# EAGLE design MightyWatt R3 (EAGLE 6.5.0)
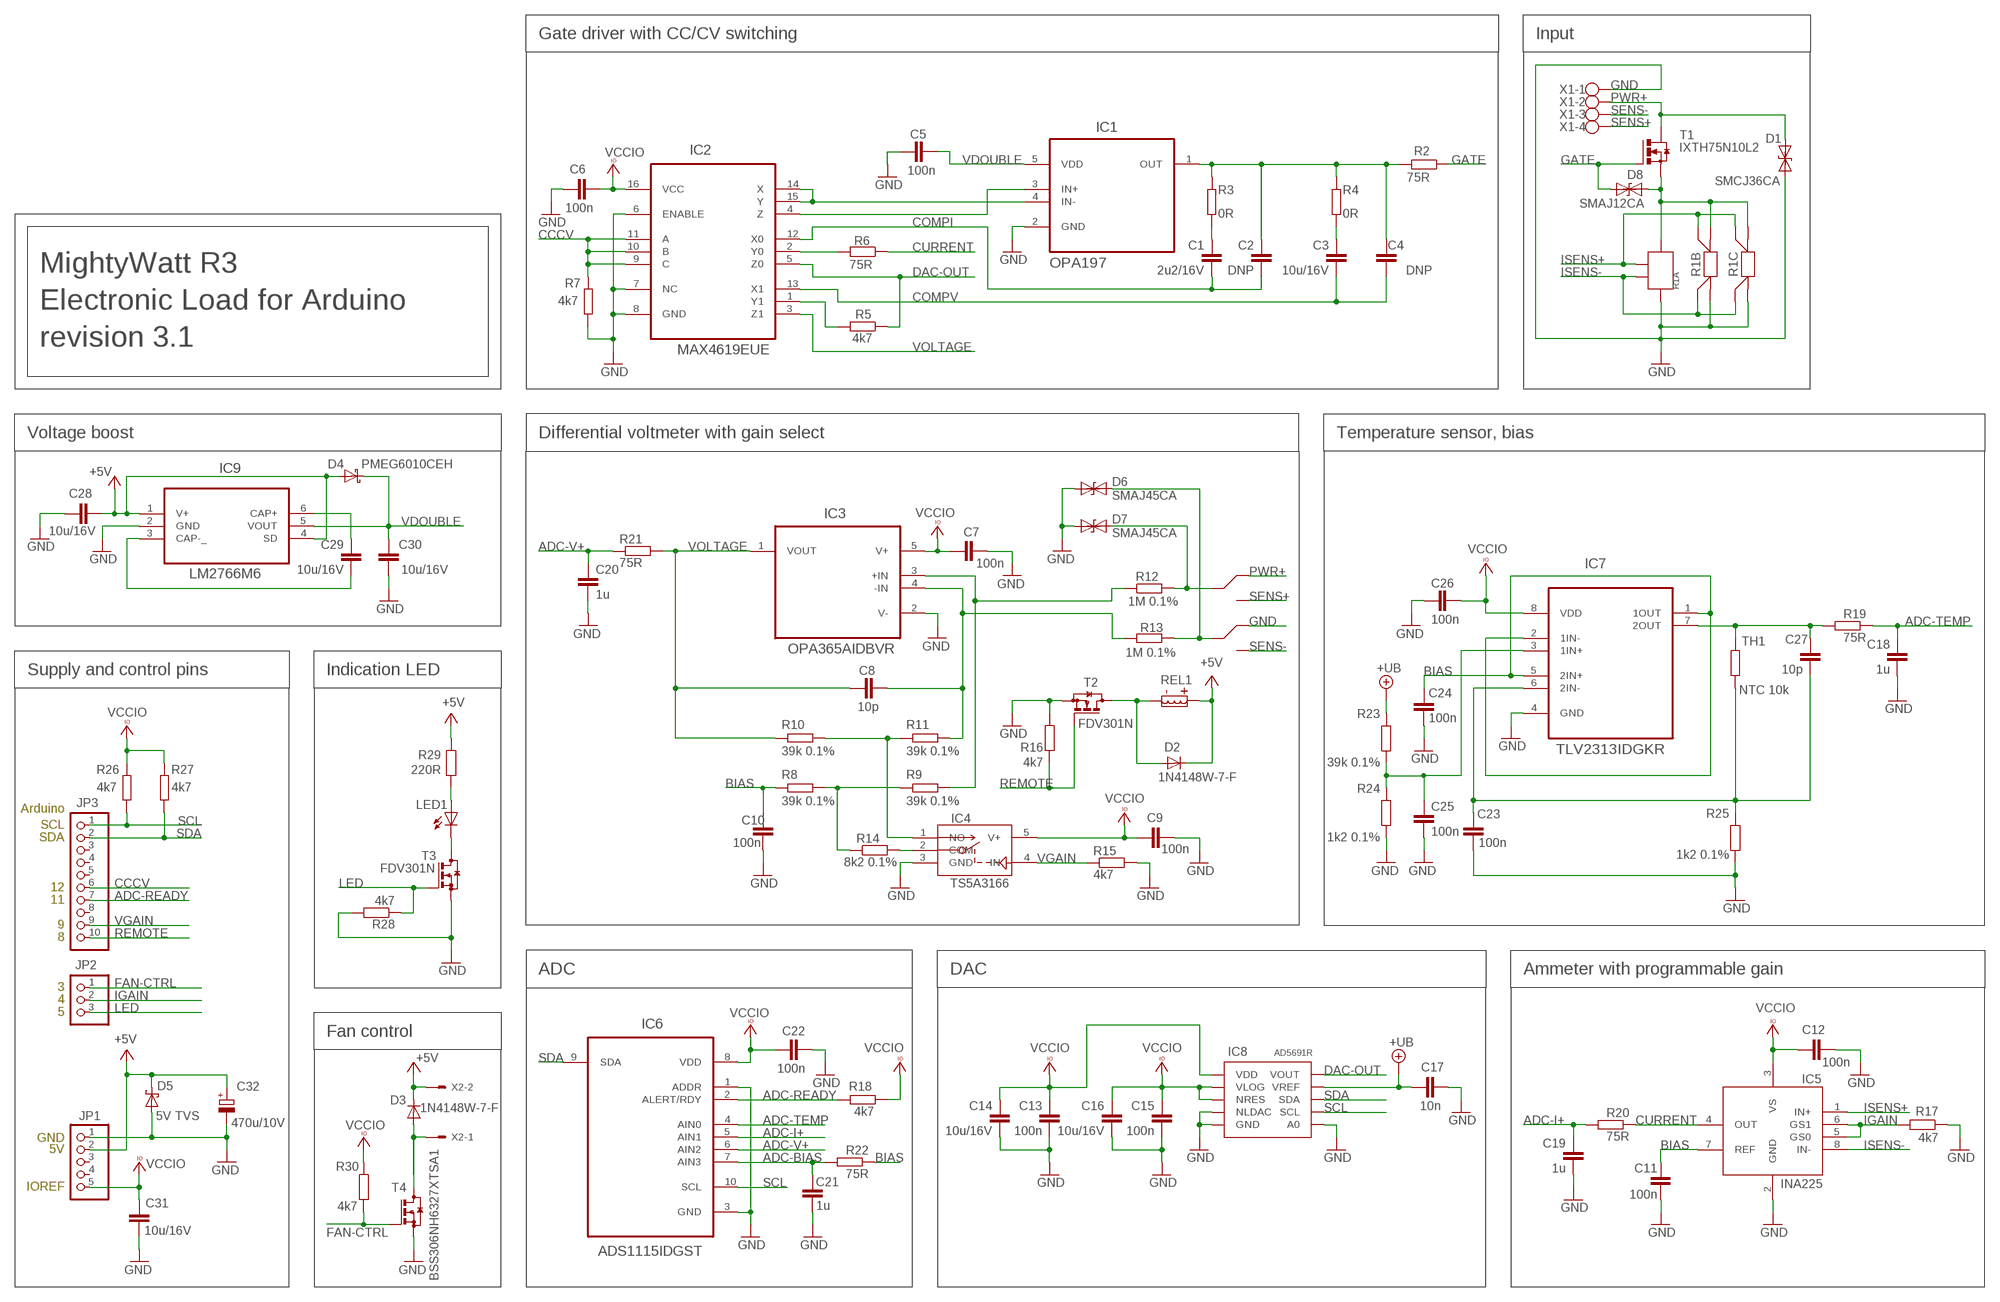
[diagram p0: schematic, sheet 1]

## Parts
C1  2u2/16V  C-EUC1206  [C1206]
C2  DNP  C-EUC0603  [C0603]
C3  10u/16V  C-EUC1206  [C1206]
C4  DNP  C-EUC0603  [C0603]
C5  100n  C-EUC0603  [C0603]
C6  100n  C-EUC0603  [C0603]
C7  100n  C-EUC0603  [C0603]
C8  10p  C-EUC0603  [C0603]
C9  100n  C-EUC0603  [C0603]
C10  100n  C-EUC0603  [C0603]
C11  100n  C-EUC0603  [C0603]
C12  100n  C-EUC0603  [C0603]
C13  100n  C-EUC0603  [C0603]
C14  10u/16V  C-EUC1206  [C1206]
C15  100n  C-EUC0603  [C0603]
C16  10u/16V  C-EUC1206  [C1206]
C17  10n  C-EUC0603  [C0603]
C18  1u  C-EUC0603  [C0603]
C19  1u  C-EUC0603  [C0603]
C20  1u  C-EUC0603  [C0603]
C21  1u  C-EUC0603  [C0603]
C22  100n  C-EUC0603  [C0603]
C23  100n  C-EUC0603  [C0603]
C24  100n  C-EUC0603  [C0603]
C25  100n  C-EUC0603  [C0603]
C26  100n  C-EUC0603  [C0603]
C27  10p  C-EUC0603  [C0603]
C28  10u/16V  C-EUC1206  [C1206]
C29  10u/16V  C-EUC1206  [C1206]
C30  10u/16V  C-EUC1206  [C1206]
C31  10u/16V  C-EUC1206  [C1206]
C32  470u/10V  CPOL-EUSMCE  [SMC_E]
D1  SMCJ36CA  DIODE2SMC  [SMC]
D2  1N4148W-7-F  DIODE-SOD123  [SOD123]
D3  1N4148W-7-F  DIODE-SOD123  [SOD123]
D4  PMEG6010CEH  DIODE-SOD123  [SOD123]
D5  5V TVS  SCHOTTKY-DIODESMD  [SMB]
D6  SMAJ45CA  DIODE2DO-214AC  [DO-214AC]
D7  SMAJ45CA  DIODE2DO-214AC  [DO-214AC]
D8  SMAJ12CA  DIODE2DO-214AC  [DO-214AC]
IC1  TLV271IDBVR  [SOT95P280X145-5N]
IC2  MAX4619EUE  [SOP65P640X120-16N]
IC3  OPA365AIDBVR  [SOT95P280X145-5N]
IC4  TS5A3166  [SC70-5]
IC5  INA225  [MSOP8]
IC6  ADS1115IDGST  [SOP50P490X110-10N]
IC7  TLV2372IDGK  [SOP65P490X110-8N]
IC8  AD5691RAD5691R  [SOP50P490X110-10N]
IC9  LM2766M6  [SOT95P285X122-6N]
JP1  SUPPLY  PINHD-1X5  [1X05]
JP2  CONTROL, LED  PINHD-1X3  [1X03]
JP3  TWI  PINHD-1X10  [1X10]
LED1  LEDCHIP-LED0805  [CHIP-LED0805]
R1A  WSL3637  [POWER-R-4TERM]
R1B  LVK24  [LVK24]
R1C  LVK12  [1206-4WIRE]
R2  75R  R-EU_R0603  [R0603]
R3  0R  R-EU_R0603  [R0603]
R4  0R  R-EU_R0603  [R0603]
R5  4k7  R-EU_R0603  [R0603]
R6  75R  R-EU_R0603  [R0603]
R7  4k7  R-EU_R0603  [R0603]
R8  39k 0.1%  R-EU_R0603  [R0603]
R9  39k 0.1%  R-EU_R0603  [R0603]
R10  39k 0.1%  R-EU_R0603  [R0603]
R11  39k 0.1%  R-EU_R0603  [R0603]
R12  1M 0.1%  R-EU_R0603  [R0603]
R13  1M 0.1%  R-EU_R0603  [R0603]
R14  8k2 0.1%  R-EU_R0603  [R0603]
R15  4k7  R-EU_R0603  [R0603]
R16  4k7  R-EU_R0603  [R0603]
R17  4k7  R-EU_R0603  [R0603]
R18  4k7  R-EU_R0603  [R0603]
R19  75R  R-EU_R0603  [R0603]
R20  75R  R-EU_R0603  [R0603]
R21  75R  R-EU_R0603  [R0603]
R22  75R  R-EU_R0603  [R0603]
R23  39k 0.1%  R-EU_R0603  [R0603]
R24  1k2 0.1%  R-EU_R0603  [R0603]
R25  1k2 0.1%  R-EU_R0603  [R0603]
R26  4k7  R-EU_R0603  [R0603]
R27  4k7  R-EU_R0603  [R0603]
R28  4k7  R-EU_R0603  [R0603]
R29  220R  R-EU_R0603  [R0603]
R30  4k7  R-EU_R0603  [R0603]
REL1  IM03NS  [IM03NS-NARROW-RELAY]
T1  IXTH75N10L2  [TO247-BLANK]
T2  BSS123  [SOT23]
T3  BSS123  [SOT23]
T4  BSS123  [SOT23]
TH1  NTC 10k  R-EU_R0402  [R0402]
X1  W237-4  [W237-4]
X2  22-23-2021  [22-23-2021]

## Nets
+5V: C28.1 C32.+ D2.C D3.C D4.A D5.C IC9.1(V+) IC9.4(SD) JP1.2 R29.1 REL1.P$1(COIL:C+) X2.2
+UB: C17.2 IC8.9(VREF) R23.2
ADC-BIAS: C21.2 IC6.7(AIN3) R22.2
ADC-I+: C19.2 IC6.5(AIN1) R20.2
ADC-READY: IC6.2(ALERT/RDY) JP3.7 R18.1
ADC-TEMP: C18.2 IC6.4(AIN0) R19.1
ADC-V+: C20.2 IC6.6(AIN2) R21.1
BIAS: C10.2 C11.2 C24.2 IC5.7(REF) IC7.1(1OUT) IC7.2(1IN-) IC7.5(2IN+) R8.1 R22.1
CCCV: IC2.9(C) IC2.10(B) IC2.11(A) JP3.6 R7.2
COMPI: C1.1 C2.1 IC2.12(X0)
COMPV: C3.1 C4.1 IC2.13(X1)
CURRENT: IC5.4(OUT) R6.1 R20.1
DAC-OUT: IC2.5(Z0) IC8.10(VOUT) R5.1
FAN-CTRL: JP2.1 R30.2 T4.1(G)
GATE: D8.C R2.1 T1.G
GND: C5.1 C6.2 C7.2 C9.1 C10.1 C11.1 C12.2 C13.1 C14.2 C15.1 C16.2 C17.1 C18.1 C19.1 C20.1 C21.1 C22.2 C23.1 C24.1 C25.1 C26.2 C28.2 C30.2 C31.2 C32.- D1.A D5.A D6.A D7.A IC1.2(GND) IC2.6(ENABLE) IC2.7(NC) IC2.8(GND) IC3.2(V-) IC4.3(GND) IC5.2(GND) IC6.1(ADDR) IC6.3(GND) IC7.4(GND) IC8.4(NLDAC) IC8.5(GND) IC8.6(A0) IC9.2(GND) JP1.1 R1A.POWER1 R1B.I1 R1C.I1 R7.1 R15.2 R16.1 R17.1 R24.1 R25.1 R28.2 REL1.P$2(S1:NC) T2.2(S) T3.2(S) T4.2(S) X1.1
IGAIN: IC5.5(GS0) IC5.6(GS1) JP2.2 R17.2
ISENS+: IC5.1(IN+) R1A.SENSE2 R1B.V2 R1C.V2
ISENS-: IC5.8(IN-) R1A.SENSE1 R1B.V1 R1C.V1
LED: JP2.3 R28.1 T3.1(G)
N$1: IC1.3(IN+) IC2.4(Z)
N$2: IC2.2(Y0) R6.2
N$3: C23.2 C27.1 IC7.6(2IN-) R25.2 TH1.1
N$4: LED1.C T3.3(D)
N$5: C29.1 IC9.6(CAP+)
N$6: C29.2 IC9.3(CAP-_)
N$9: C1.2 R3.2
N$10: IC1.4(IN-) IC2.14(X) IC2.15(Y)
N$11: D8.A R1A.POWER2 R1B.I2 R1C.I2 T1.S
N$12: C2.2 C4.2 IC1.1(OUT) R2.2 R3.1 R4.1
N$13: D7.C R12.2 REL1.P$6(S2:COM)
N$14: C27.2 IC7.7(2OUT) R19.2 TH1.2
N$15: IC2.1(Y1) R5.2
N$16: LED1.A R29.2
N$17: D6.C R13.1 REL1.P$3(S1:COM)
N$18: C3.2 R4.2
N$20: C25.2 IC7.3(1IN+) R23.1 R24.2
N$22: C8.2 IC3.4(-IN) R11.2 R13.2
N$24: D2.A REL1.P$8(COIL:C-) T2.3(D)
N$26: D3.A T4.3(D) X2.1
N$30: IC4.1(NO) R10.2 R11.1
N$34: IC3.3(+IN) R9.2 R12.1
N$36: IC4.2(COM) R14.2
N$37: R8.2 R9.1 R14.1
PWR+: D1.C REL1.P$7(S2:NC) T1.D X1.2
REMOTE: JP3.10 R16.2 T2.1(G)
SCL: IC6.10(SCL) IC8.7(SCL) JP3.1 R26.1
SDA: IC6.9(SDA) IC8.8(SDA) JP3.2 R27.1
SENS+: REL1.P$5(S2:NO) X1.4
SENS-: REL1.P$4(S1:NO) X1.3
VCCIO: C6.1 C7.1 C9.2 C12.1 C13.2 C14.1 C15.2 C16.1 C22.1 C26.1 C31.1 IC2.16(VCC) IC3.5(V+) IC4.5(V+) IC5.3(VS) IC6.8(VDD) IC7.8(VDD) IC8.1(VDD) IC8.2(VLOG) IC8.3(NRES) JP1.5 R18.2 R26.2 R27.2 R30.1
VDOUBLE: C5.2 C30.1 D4.C IC1.5(VDD) IC9.5(VOUT)
VGAIN: IC4.4(IN) JP3.9 R15.1
VOLTAGE: C8.1 IC2.3(Z1) IC3.1(VOUT) R10.1 R21.2
Unconnected: JP1.3 JP1.4 JP3.3 JP3.4 JP3.5 JP3.8

## Notes on the sheet
- Gate driver with CC/CV switching | Input
- MightyWatt R3
  Electronic Load for Arduino
  revision 3.1
- Voltage boost | Differential voltmeter with gain select | Temperature sensor, bias
- Supply and control pins | Indication LED
- Arduino
- SCL
- SDA
- 12
- 11
- 9
- 8
- ADC | DAC | Ammeter with programmable gain
- 3
- 4
- 5
- Fan control
- GND
- 5V
- IOREF

## Library data of the parts
C1-C31 = rcl:C-EU: CAPACITOR, European symbol
C32 = rcl:CPOL-EU: POLARIZED CAPACITOR, European symbol; PARTN: TPSB476K010R0250
D1 D6-D8 = kaktus:DIODE2: DIODE
D2 D3 = diode:DIODE-: DIODE
D4 = diode-schottky:DIODE-: DIODE
D5 = diode:SCHOTTKY-DIODE: Schottky Diode
IC1 = Texas Instruments_By_element14_Batch_1:TLV271IDBVR: OPERATIONAL AMPLIFIERS; MPN: OPA197; OC_FARNELL: 1575646; OC_NEWARK: 76C8471; PACKAGE: SOT-23-5; SUPPLIER: Texas Instruments
IC2 = kaktus:MAX4619EUE: SPDT Switches; PACKAGE: TSSOP-16
IC3 = Texas Instruments_By_element14_Batch_1:OPA365AIDBVR: 50MHz, Low-Distortion, High CMRR RRI/O, Single-Supply OPERATIONAL AMPLIFIER; MPN: OPA365AIDBVR; OC_FARNELL: -; OC_NEWARK: 03M9400; PACKAGE: SOT-23-5; SUPPLIER: Texas Instruments
IC4 = load:TS5A3166: 0.9-Ohm SPST analog switch
IC5 = ina225:INA225
IC6 = Texas Instruments_By_element14_Batch_1:ADS1115IDGST: Analog-to-Digital Converter with Internal Reference; MPN: ADS1015IDGST; OC_FARNELL: 1762981; OC_NEWARK: 25R1241; PACKAGE: MSOP-10; SUPPLIER: Texas Instruments
IC7 = Texas Instruments_By_element14_Batch_1:TLV2372IDGK: Operatinal Amplifiers; MPN: TLV2313IDGKR; OC_FARNELL: -; OC_NEWARK: 76C7973; PACKAGE: MSOP-8; SUPPLIER: Texas Instruments
IC8 = r2.5-3:AD5691R: Analog Devices AD5691R 12-bit DAC I2C, REF out; MODEL: AD5691R
IC9 = texas:LM2766M6: IC SW CAP/DBLR ADJ 20MA; MPN: LM2766M6; OC_FARNELL: 1685633; OC_NEWARK: 41K4345; PACKAGE: SOT-23-6; SUPPLIER: National Semiconductor
JP1 = pinhead:PINHD-1X5: PIN HEADER
JP2 = pinhead:PINHD-1X3: PIN HEADER
JP3 = pinhead:PINHD-1X10: PIN HEADER
LED1 = led:LED: LED OSRAM: - CHIPLED LG R971, LG N971, LY N971, LG Q971, LY Q971, LO R971, LY R971 LH N974, LH R974 LS Q976, LO Q976, LY Q976 LO Q996 - Hyper CHIPLED LW Q18S LB Q993, LB Q99A, LB R99A - SideLED LS A670, LO A670, LY A670, LG A670, LP A670 LB A673, LV A673, LT A673, LW A673 LH A674 LY A675 LS A676, LA A676, LO A676, LY A676, LW A676 LS A679, LY A679, LG A679 - Hyper Micro SIDELED® LS Y876, LA Y876, LO Y876, LY Y876 LT Y87S - SmartLED LW L88C, LW L88S LB L89C, LB L89S, LG L890 LS L89K, LO L89K, LY L89K LS L896, LA L896, LO L896, LY L896 - TOPLED LS T670, LO T670, LY T670, LG T670, LP T670 LSG T670, LSP T670, LSY T670, LOP T670, LYG T670 LG T671, LOG T671, LSG T671 LB T673, LV T673, LT T673, LW T673 LH T674 LS T676, LA T676, LO T676, LY T676, LB T676, LH T676, LSB T676, LW T676 LB T67C, LV T67C, LT T67C, LS T67K, LO T67K, LY T67K, LW E67C LS E67B, LA E67B, LO E67B, LY E67B, LB E67C, LV E67C, LT E67C LW T67C LS T679, LY T679, LG T679 LS T770, LO T770, LY T770, LG T770, LP T770 LB T773, LV T773, LT T773, LW T773 LH T774 LS E675, LA E675, LY E675, LS T675 LS T776, LA T776, LO T776, LY T776, LB T776 LHGB T686 LT T68C, LB T68C - Hyper Mini TOPLED® LB M676 - Mini TOPLED Santana® LG M470 LS M47K, LO M47K, LY M47K Source: http://www.osram.convergy.de LUXEON: - LUMILED® LXK2-PW12-R00, LXK2-PW12-S00, LXK2-PW14-U00, LXK2-PW14-V00 LXK2-PM12-R00, LXK2-PM12-S00, LXK2-PM14-U00 LXK2-PE12-Q00, LXK2-PE12-R00, LXK2-PE12-S00, LXK2-PE14-T00, LXK2-PE14-U00 LXK2-PB12-K00, LXK2-PB12-L00, LXK2-PB12-M00, LXK2-PB14-N00, LXK2-PB14-P00, LXK2-PB14-Q00 LXK2-PR12-L00, LXK2-PR12-M00, LXK2-PR14-Q00, LXK2-PR14-R00 LXK2-PD12-Q00, LXK2-PD12-R00, LXK2-PD12-S00 LXK2-PH12-R00, LXK2-PH12-S00 LXK2-PL12-P00, LXK2-PL12-Q00, LXK2-PL12-R00 Source: www.luxeon.com KINGBRIGHT: KA-3528ASYC Source: www.kingbright.com
R1A = moje:WSL3637
R1B = kaktus:LVK24: LVK24 Four Terminal Current Sense Resistor
R1C = kaktus:LVK12: Current shunt resistor Ohmite LVK12 series
R2-R30 TH1 = rcl:R-EU_: RESISTOR, European symbol
REL1 = kaktus:IM03NS: Relay DPDT THT narrow 5V: IM03NS, UA2-5NU; REL1: REL1
T1 = kaktus:IXTH75N10L2: N-Channel Enhancement Power MOISFET Linear L2 Power MOSFET w/extended FBSOA
T2 T3 = transistor-small-signal:BSS123: N-CHANNEL MOS FET; PARTNAME: FDV301N
T4 = transistor-small-signal:BSS123: N-CHANNEL MOS FET; PARTNAME: BSS306NH6327XTSA1
X1 = con-wago-500-modified:W237-4: WAGO SCREW CLAMP; OC_FARNELL: unknown; OC_NEWARK: unknown
X2 = con-molex:22-23-2021: .100" (2.54mm) Center Header - 2 Pin; MF: MOLEX; MPN: 22-23-2021; OC_FARNELL: 1462926; OC_NEWARK: 25C3832

## Board
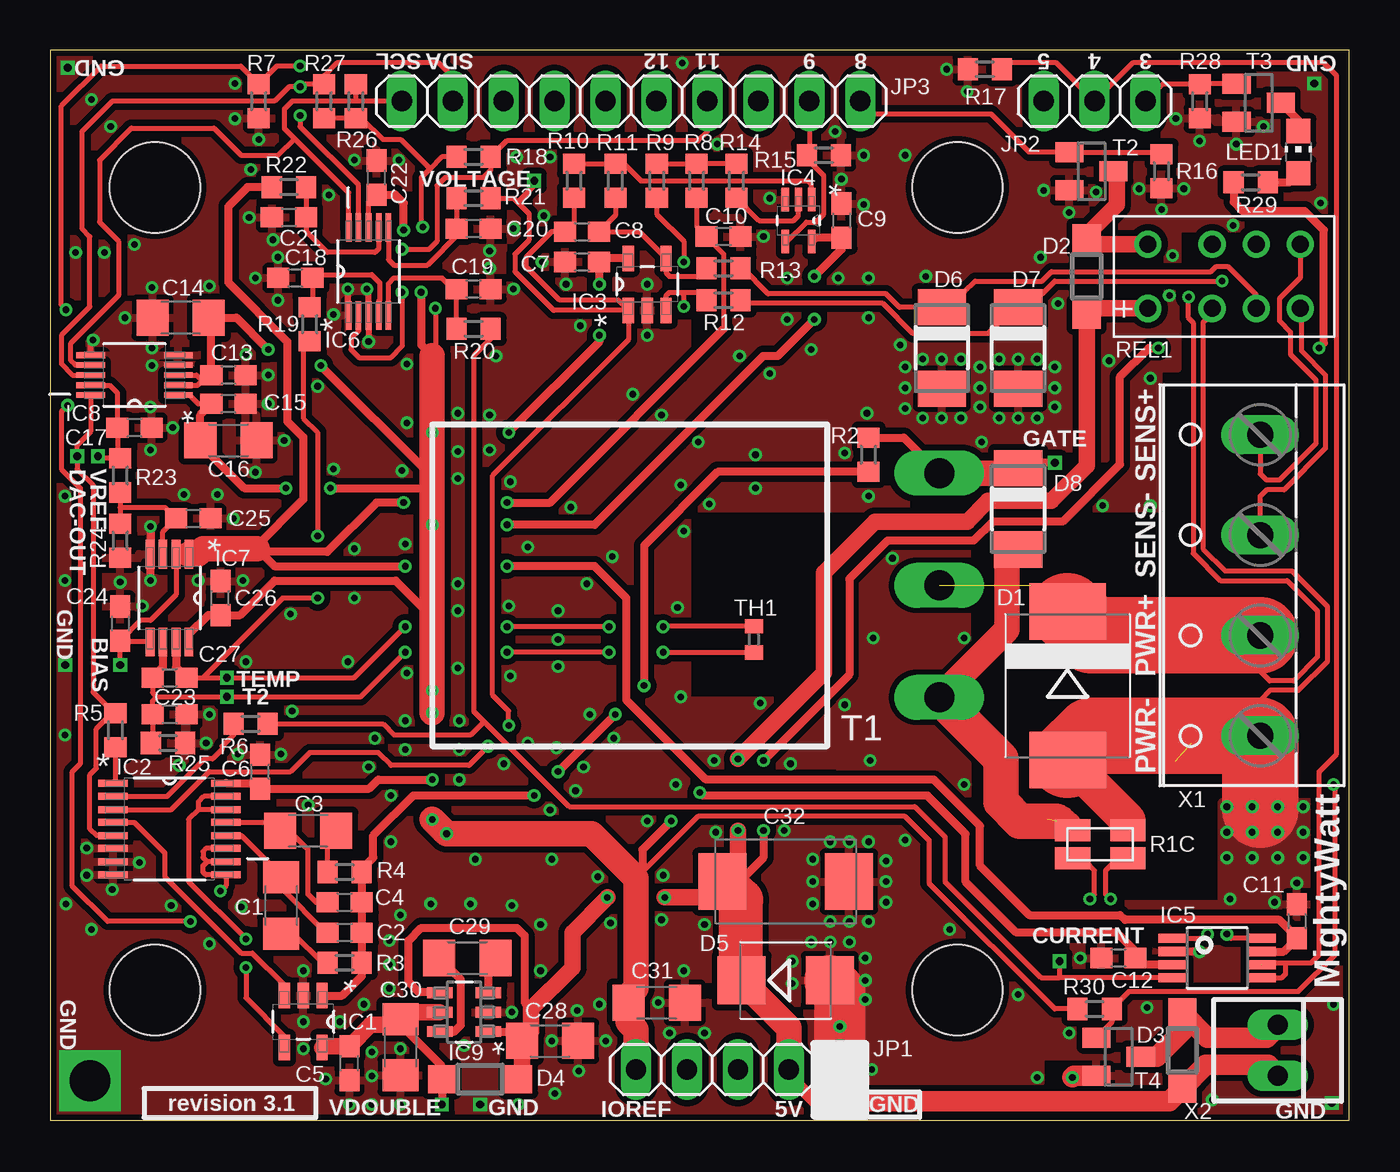
[diagram p1: board, top side]
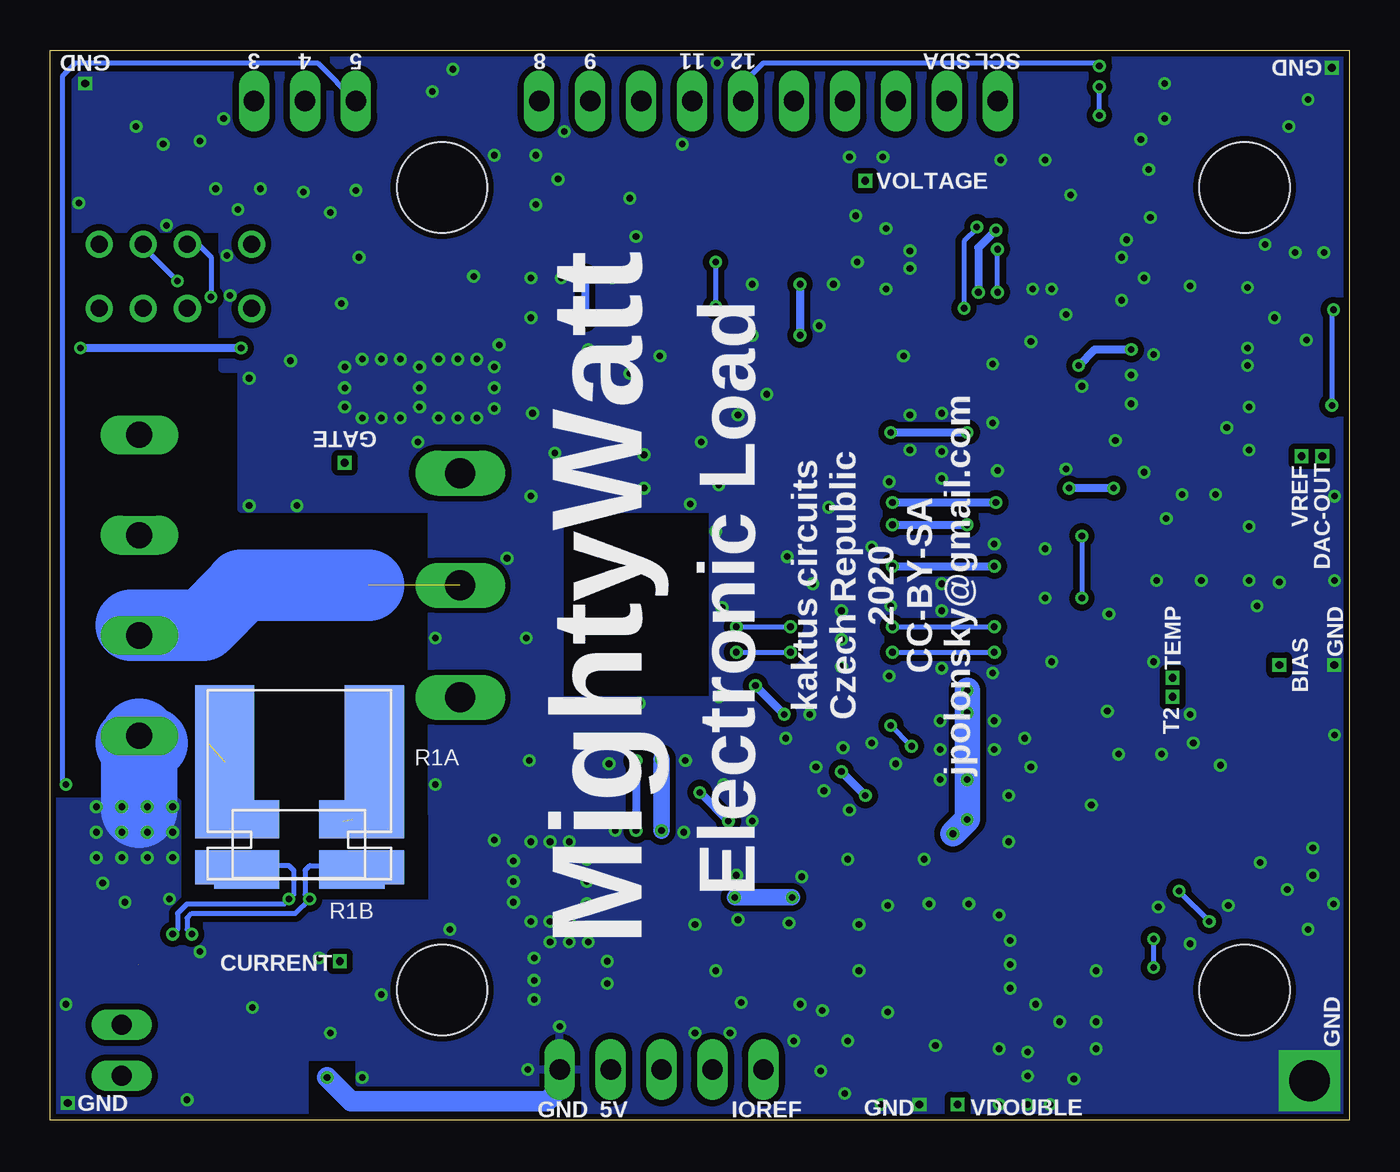
[diagram p2: board, bottom side, seen from below]

Size 64.77 x 53.34 mm. Coordinates in mm from the lower left corner, seen from the top.
Outline: 0,0 64.77,0 64.77,53.34 0,53.34 0,0
Copper layers (1*16): Top 0.035mm / dielectric 1.5mm / Bottom 0.035mm
Design rules "SeeedStudio_2layer_DRU_no_angle_20140221 *": minimum track width 6mil, minimum drill 12mil, track to track 6mil, track to pad 6mil, pad to pad 6mil, via to via 6mil, smd to smd 0mil, copper to edge 10mil, drill to drill 10mil, minimum pad ring 10mil, minimum via ring 6mil, stop-mask expansion 2mil, vias tented up to drill 14mil, thermal gap 10mil
Holes 4.5 mm at 5.23,6.5 5.23,46.5 45.23,46.5 45.23,6.5

### Footprints (pad centres in the part's own frame; a part is rotated, then mirrored left to right if it is on the bottom)
C1206 = smd 1.6 x 1.8: 1 -1.4,0; 2 1.4,0
C0603 = smd 1.1 x 1: 1 -0.85,0; 2 0.85,0
SMC_E = smd 2.4 x 2.8: + -3.15,0; - 3.15,0
SMC = smd 2.8 x 3.8: A 3.7,0; C -3.7,0
SOD123 = smd 1.4 x 1.4: A 1.9,0; C -1.9,0
SMB = smd 2.4 x 2.4: A 2.2,0; C -2.2,0
DO-214AC = smd 1.8 x 2.4: A 2.025,0; C -2.025,0
SOT95P280X145-5N = smd 1.27 x 0.559: 1 -1.295,0.94; 2 -1.295,0; 3 -1.295,-0.94; 4 1.295,-0.94; 5 1.295,0.94
SOP65P640X120-16N = smd 1.473 x 0.356: 1 -2.819,2.286; 2 -2.819,1.626; 3 -2.819,0.965; 4 -2.819,0.33; 5 -2.819,-0.33; 6 -2.819,-0.965; 7 -2.819,-1.626; 8 -2.819,-2.286; 9 2.819,-2.286; 10 2.819,-1.626; 11 2.819,-0.965; 12 2.819,-0.33; 13 2.819,0.33; 14 2.819,0.965; 15 2.819,1.626; 16 2.819,2.286
SC70-5 = smd 1.168 x 0.356: 1 -1.041,0.66; 2 -1.041,0; 3 -1.041,-0.66; 4 1.041,-0.66; 5 1.041,0.66
MSOP8 = smd 0.45 x 1.45: 1 -0.975,-2.2; 2 -0.325,-2.2; 3 0.325,-2.2; 4 0.975,-2.2; 5 0.975,2.2; 6 0.325,2.2; 7 -0.325,2.2; 8 -0.975,2.2
SOP50P490X110-10N = smd 1.422 x 0.279: 1 -2.184,0.991; 2 -2.184,0.508; 3 -2.184,0; 4 -2.184,-0.508; 5 -2.184,-0.991; 6 2.184,-0.991; 7 2.184,-0.508; 8 2.184,0; 9 2.184,0.508; 10 2.184,0.991
SOP65P490X110-8N = smd 1.422 x 0.432: 1 -2.184,0.965; 2 -2.184,0.33; 3 -2.184,-0.33; 4 -2.184,-0.965; 5 2.184,-0.965; 6 2.184,-0.33; 7 2.184,0.33; 8 2.184,0.965
SOT95P285X122-6N = smd 1.27 x 0.533: 1 -1.219,0.965; 2 -1.219,0; 3 -1.219,-0.965; 4 1.219,-0.965; 5 1.219,0; 6 1.219,0.965
1X05 = drill 1.016 long: 1 -5.08,0; 2 -2.54,0; 3 0,0; 4 2.54,0; 5 5.08,0
1X03 = drill 1.016 long: 1 -2.54,0; 2 0,0; 3 2.54,0
1X10 = drill 1.016 long: 1 -11.43,0; 2 -8.89,0; 3 -6.35,0; 4 -3.81,0; 5 -1.27,0; 6 1.27,0; 7 3.81,0; 8 6.35,0; 9 8.89,0; 10 11.43,0
CHIP-LED0805 = smd 1.2 x 1.2: A 0,-1.05; C 0,1.05
POWER-R-4TERM = smd 7.62 x 2.946: POWER1 1.016,-2.972; POWER2 1.016,4.496 | smd 1.676 x 2.946: SENSE1 6.274,-2.972; SENSE2 6.274,4.496
LVK24 = smd 3.25 x 1.9: I1 -2.65,1.25; I2 2.6,1.25; V1 -2.65,-1.25; V2 2.6,-1.25
1206-4WIRE = smd 1.75 x 1.1: I1 -1.4,-0.7; I2 1.35,-0.7; V1 -1.4,0.7; V2 1.35,0.7
R0603 = smd 1 x 1.1: 1 -0.85,0; 2 0.85,0
IM03NS-NARROW-RELAY = drill 0.85: P$1 -2.5,-1.6; P$2 0.7,-1.6; P$3 2.9,-1.6; P$4 5.1,-1.6; P$5 5.1,1.6; P$6 2.9,1.6; P$7 0.7,1.6; P$8 -2.5,1.6
TO247-BLANK = drill 1.499 long: D 0,-10.16; G -5.588,-10.16; S 5.588,-10.16
SOT23 = smd 1 x 1.4: 1 -0.95,-1.1; 2 0.95,-1.1; 3 0,1.1
R0402 = smd 0.7 x 0.9: 1 -0.65,0; 2 0.65,0
W237-4 = drill 1.3 long: 1 -7.5,-1.27; 2 -2.5,-1.27; 3 2.5,-1.27; 4 7.5,-1.27
22-23-2021 = drill 1 long: 1 -1.27,0; 2 1.27,0

### Placement (x,y rotation side)
C1  11.51,10.72 270 top
C2  14.68,9.37 0 top
C3  12.86,14.45 0 top
C4  14.68,10.87 0 top
C5  14.92,2.86 90 top
C6  10.48,17.38 90 top
C7  26.51,42.78 180 top
C8  26.51,44.29 0 top
C9  39.45,44.85 270 top
C10  33.58,44.05 180 top
C11  62.15,9.92 270 top
C12  53.26,8.1 180 top
C13  8.89,37.15 180 top
C14  6.51,40.01 180 top
C15  8.89,35.72 180 top
C16  8.89,33.89 0 top
C17  4.21,34.53 180 top
C18  12.22,41.99 0 top
C19  21.11,41.43 180 top
C20  21.11,44.45 180 top
C21  11.91,45.01 0 top
C22  16.27,46.99 90 top
C23  5.95,20.24 180 top
C24  3.49,24.77 270 top
C25  7.14,30 180 top
C26  8.49,26.04 90 top
C27  5.95,22.07 0 top
C28  24.92,3.97 0 top
C29  20.8,8.1 0 top
C30  17.46,3.65 270 top
C31  30.24,5.87 0 top
C32  36.67,11.91 0 top
D1  50.72,21.67 270 top
D2  51.67,42.07 90 top
D3  56.44,3.49 90 top
D4  21.43,2.06 0 top
D5  36.67,6.99 0 top
D6  44.45,38.5 270 top
D7  48.26,38.5 270 top
D8  48.26,30.48 270 top
IC1  12.62,4.92 270 top
IC2  5.95,14.53 0 top
IC3  29.77,41.67 90 top
IC4  37.31,44.85 270 top
IC5  58.18,8.1 270 top
IC6  15.88,42.31 90 top
IC7  5.95,26.04 270 top
IC8  4.21,37.15 180 top
IC9  20.64,5.4 180 top
JP1  34.29,2.54 180 top
JP2  52.07,50.8 0 top
JP3  28.96,50.8 0 top
LED1  62.23,48.26 0 top
R1A  53.1,18.89 270 bottom
R1B  52.32,13.76 0 bottom
R1C  52.32,13.76 180 top
R2  40.8,33.18 270 top
R3  14.68,7.86 180 top
R4  14.68,12.38 180 top
R5  3.25,19.45 270 top
R6  10,19.76 180 top
R7  10.4,50.8 90 top
R8  32.23,46.83 90 top
R9  30.24,46.83 270 top
R10  26.11,46.83 90 top
R11  28.18,46.83 270 top
R12  33.58,40.88 0 top
R13  33.58,42.47 180 top
R14  34.21,46.83 270 top
R15  38.58,48.1 0 top
R16  55.4,47.31 90 top
R17  46.59,52.39 0 top
R18  21.11,48.02 180 top
R19  12.94,39.69 270 top
R20  21.11,39.45 180 top
R21  21.11,45.96 0 top
R22  11.91,46.51 0 top
R23  3.49,32.15 90 top
R24  3.49,28.89 90 top
R25  5.87,18.81 180 top
R26  15.24,50.8 270 top
R27  13.65,50.8 270 top
R28  57.31,50.8 270 top
R29  59.85,46.75 0 top
R30  52.07,5.56 0 top
REL1  57.23,42.07 0 top
T1  34.16,26.67 270 bottom
T2  51.91,47.31 270 top
T3  60.25,50.72 270 top
T4  53.26,3.17 270 top
TH1  35.08,23.97 90 top
X1  59.05,26.67 90 top
X2  61.2,3.49 270 top

### Tracks (layer width: path | path; a pad name or v marks a point on that pad's centre or on a via)
+5V  (via drill 0.33)
  Top 0.406: IC9.4 19.42,6.4 18.36,6.4 17.86,6.91 17.86,8.97 18.49,9.6 23.26,9.6 23.65,9.21 23.65,5.87 23.97,5.56 | IC9.1 23.06,4.43 C28.1 | 38.34,0.71 38.42,0.64 40.72,0.64 40.72,0.95 | v35.56,17.94 39.85,22.23 39.85,26.99 41.75,28.89 46.04,28.89 46.99,29.84 50.48,29.84 53.34,32.7 53.34,37.07 54.77,38.5 v55.24,38.5 | v35.56,14.45 35.56,13.1 34.29,11.83 34.29,12.06 | v63.26,38.5 63.5,38.73 63.5,44.37 62.55,45.32 59.45,45.32 59,45.78 R29.1
  Top 0.61: JP1.2 36.83,2.22 38.34,0.71
  Top 0.813: D4.A 23.52,2.25 C28.1 23.97,4.42 23.97,5.56 26.04,7.62 26.04,9.37 v27.78,11.11 | v34.29,18.02 38.58,22.3 38.58,27.3 41.12,29.84 45.72,29.84 46.75,30.88 49.93,30.88 51.67,32.62 D2.C 51.97,40.47 REL1.P$1 | v34.29,14.45 34.29,12.06 33.52,12.06 C32.+ 33.52,11.11 v30.64,11.11
  Top 1.016: 40.72,0.95 55.8,0.95 D3.C 57.62,2.78 60.72,2.78 61.2,2.3 X2.2
  Top 1.27: JP1.2 36.83,4.63 D5.C
  Top 2.184: D5.C 34.45,6.99 34.45,10.98 C32.+
  Bottom 0.406: v35.56,17.94 v35.56,14.45 | v55.24,38.5 v63.26,38.5
  Bottom 0.813: v27.78,11.11 v30.64,11.11 | v34.29,14.45 v34.29,18.02
+UB  (via drill 0.38)
  Top 0.254: v2.38,33.1 2.48,33 R23.2 3.36,33.13 C17.2 3.36,36.25 2.97,36.64 IC8.9
ADC-BIAS
  Top 0.254: IC6.7 16.38,43.45 16.19,43.26 13.81,43.26 12.76,44.31 C21.2 R22.2
ADC-I+
  Top 0.254: R20.2 C19.2 | 20.11,41.59 C19.2 | IC6.5 16.87,41.71 17.14,41.99 19.53,41.99 20.08,41.43 C19.2 | 20.24,41.46 C19.2
ADC-READY  (via drill 0.33)
  Top 0.254: JP3.7 32.77,49.28 32.31,48.82 22.76,48.82 R18.1 21.96,47.36 21.59,46.99 19.68,46.99 19.29,46.59 19.29,43.81 18.89,43.42 v17.54,43.42 | IC6.2 15.37,39.34 15,38.97 15,38.42 15.4,38.02 16.99,38.02 17.54,38.58 v17.54,41.27
  Bottom 0.254: v17.54,41.27 v17.54,43.42
ADC-TEMP
  Top 0.254: 12.76,42.05 12.86,42.15 12.91,42.15 | IC6.4 16.38,40.83 16.43,40.88 16.43,41.75 16.03,42.15 12.91,42.15 | R19.1 13.07,40.67 C18.2 12.91,42.15
ADC-V+
  Top 0.254: R21.1 C20.2 20.24,44.43 20.3,44.43 20.32,44.45 20.32,44.13 18.81,42.62 17.14,42.62 16.87,42.9 IC6.6
BIAS  (via drill 0.33, 0.38)
  Top 0.254: R8.1 32.23,44.55 C10.2 32.73,44.03 33.58,43.18 33.58,39.45 | IC7.1 IC7.2 6.28,26.21 5,24.92 4.5,24.92 C24.2 | IC7.5 3.56,23.85 C24.2 | v3.49,22.7 C24.2
  Top 0.406: v22.78,30.8 24.92,30.8 33.58,39.45 | R22.1 9.84,46.51 8.89,45.56 8.89,41.75 11.83,38.81 11.83,34.85 12.62,34.05 12.62,30.96 10.16,28.5 | v22.78,27.62 27.15,27.62 28.73,26.04 28.73,20.95 32.7,16.99 44.05,16.99 46.35,14.68 46.35,12.7 48.82,10.24 53.34,10.24 53.58,10 61.28,10 62.15,9.13 C11.2 61.5,8.42 IC5.7 | 10.32,28.5 11.19,27.62 v17.7,27.62 | v17.62,30.8 16.27,30.8 13.81,28.34 10.16,28.34 10,28.5
  Top 1.27: IC7.1 7.34,28.22 7.62,28.5 10,28.5 10.16,28.5 10.32,28.5
  Bottom 0.406: v22.78,27.62 v17.7,27.62 | v17.62,30.8 v22.78,30.8
CCCV  (via drill 0.33)
  Top 0.254: v0.79,40.4 0.56,40.64 0.56,50.56 2.54,52.55 9.5,52.55 R7.2 11.29,52.55 v12.46,52.55 | v0.87,35.64 0.56,35.32 0.56,32.46 1.51,31.51 1.51,17.78 1.11,17.38 1.11,11.67 2.86,9.92 v6.99,9.92 | v8.49,11.43 8.77,11.71 IC2.9 7.76,12.24 7.62,12.38 7.62,12.7 7.82,12.9 | IC2.11 7.77,13.56 7.62,13.41 7.62,13.1 7.82,12.9 | IC2.10 7.82,12.9
  Bottom 0.254: JP3.6 30.23,51.69 29.21,52.7 12.62,52.7 v12.46,52.55 | v0.87,35.64 0.87,40.32 v0.79,40.4 | v8.49,11.43 v6.99,9.92
COMPI
  Top 0.254: C2.1 13.73,9.37 11.51,11.59 C1.1 11.51,12.22 9.54,14.2 IC2.12
COMPV
  Top 0.254: C4.1 13.26,10.87 12.86,11.27 12.86,13.49 11.91,14.45 C3.1 11.05,14.86 IC2.13
CURRENT  (via drill 0.38)
  Top 0.254: R20.1 21.96,38.95 21.11,38.1 21.11,20.4 21.63,19.88 | 21.63,19.88 25.88,15.64 43.1,15.64 44.61,14.13 44.61,11.91 49.39,7.12 50.32,7.12 | 21.63,19.88 20.95,19.21 17.14,19.21 16.59,19.76 R6.1 | IC5.4 50.32,7.12 | v50.32,7.94 50.32,7.12
DAC-OUT  (via drill 0.38)
  Top 0.254: IC8.10 2.02,34.33 1.35,33.66 v1.35,33.1 1.35,32.46 2.14,31.67 2.14,21.35 3.2,20.3 R5.1 3.07,20.3 2.3,19.53 2.3,17.54 1.98,17.22 1.98,14.53 2.31,14.2 IC2.5
FAN-CTRL  (via drill 0.33)
  Top 0.254: T4.1 52.92,4.88 R30.2 53.79,6.43 62.23,6.43 64.06,8.26 64.06,16.67 v63.98,16.75
  Bottom 0.254: v63.98,16.75 64.14,16.91 64.14,52.07 63.5,52.7 51.44,52.7 JP2.1
GATE  (via drill 0.38)
  Top 0.406: R2.1 42.55,34.03 T1.G 44.29,32.29 | v50.09,32.78 48.54,32.78 D8.C
  Top 1.27: T1.G 48.01,32.26 D8.C
GND  (via drill 0.33, 0.38, 2.03)  (1 unrouted)
  Top 0.254: REL1.P$2 57.93,40.23 57.47,39.77 57.47,28.5 58.58,27.38 61.91,27.38 63.66,25.64 63.66,22.86 62.23,21.43 60.8,21.43 60.33,20.95 X1.1 60.33,19.13 | 14.84,40.01 14.84,40.08 IC6.1
  Top 0.305: v15.8,41.43 15.88,41.35 IC6.3 v15.88,38.81 | 14.84,40.01 v14.84,41.43 | IC8.6 2.02,38.77 v2.14,38.89
  Top 0.406: v57.31,8.41 IC5.2 | IC7.4 4.99,26.92 v5,26.91 | v5,29.61 5,28.1
  Top 0.813: R1C.I1 53.72,14.97
  Top 1.016: T4.2 51.04,2.23 v50.96,2.14
  Top 1.27: 59.49,18.33 X1.1 | 56.88,18.8 56.52,19.17
  Top 1.778: 53.72,14.97 D1.A
  Top 2.54: JP1.1 39.37,6.49 D5.A
  Top 3.81: X1.1 56.52,19.17 51.92,19.17 D1.A | 60.33,19.13 60.33,15.48
  Bottom 0.152: 60.96,19.05 60.72,18.81
  Bottom 0.254: 60.72,18.81 60.68,18.81 X1.1
  Bottom 0.406: R1B.I1 55.88,15.01 55.88,15.88 56.07,15.88 R1A.POWER1
  Bottom 1.016: JP1.1 39.37,1.59 40.01,0.95 49.77,0.95 v50.96,2.14
  Bottom 3.556: 60.72,18.81 59.69,18.81
  Bottom 3.81: 60.33,19.13 60.33,15.48
  other vias: 17.46,0.79 30.32,5.87 55.96,43.1 16.03,2.22 38.89,8.89 40.64,6.99 36.99,6.83 36.99,7.94 37.94,8.89 39.85,8.89 40.64,8.1 40.64,6.03 41.67,11.91 38.02,11.91 39.85,9.92 39.85,13.89 38.02,10.79 38.02,13.02 58.66,15.64 17.46,3.57 1.98,1.98 0.87,52.47 63.9,0.87 59.13,48.66 40.8,31.11 31.43,21.11 31.27,25.56 41.04,24.05 45.56,24.05 33.18,14.37 57.94,1.03 49.21,2.14 39.37,4.68 40.96,2.54 36.91,17.78 36.59,14.45 45.56,16.75 56.52,46.43 63.02,51.67 40.8,40.01 37.94,38.42 42.39,38.66 43.5,35 44.45,35 45.4,35 44.45,37.94 43.5,37.94 45.4,37.94 42.62,36.51 46.35,36.51 42.62,37.54 42.62,35.48 46.35,37.54 46.35,35.56 48.26,37.94 49.21,37.94 47.31,37.94 48.26,35 49.21,35 47.31,35 50.09,37.54 50.09,36.51 50.09,35.56 39.45,46.91 35.88,45.96 40.56,48.1 15.16,47.86 17.38,47.86 21.91,43.34 35.56,44.05 31.59,7.46 32.62,4.37 23.02,5.4 26.27,5.48 27.7,3.97 26.35,2.46 16.91,8.97 17.46,10.24 12.62,4.92 12.62,3.57 16.03,3.41 16.03,0.79 21.43,0.79 23.34,0.79 25.16,1.35 24.45,7.46 24.45,9.76 23.02,10.72 20.95,10.79 18.97,10.79 13.73,2.06 51.36,8.1 45.72,51.28 40.56,45.64 27.38,5.79 32.62,9.76 40.88,17.94 50.8,4.37 61.04,10.87 54.69,5.64 35.4,20.8 33.1,17.94 39.61,20.72 31.43,31.67 32.86,30.72 39.61,33.26 44.69,52.39 36.75,41.99 11.11,43.89 9.92,45.01 11.35,43.02 20.4,16.99 25.24,18.57 17.7,18.49 20.4,18.49 24.92,15.48 31.19,16.75 29.77,14.92 36.75,39.93 35.88,37.23 34.37,38.1 49.53,46.35 39.29,41.99 40.8,41.99 43.66,42.07 35.16,33.18 35.16,31.51 29.77,39.13 25.72,41.67 24.53,42.78 29.77,41.67 23.1,44.45 23.1,41.43 21.91,42.47 14.13,40.16 10.24,41.99 2.7,43.26 1.27,43.26 2.06,50.88 3.02,49.53 10,47.39 9.21,51.67 10.87,37.15 6.67,31.19 8.33,31.19 9.6,26.91 7.38,26.91 9.13,30 7.78,18.81 3.49,26.83 4.6,25.64 7.94,20.24 20.4,19.92 20.32,31.99 20.32,26.75 20.32,25.4 20.32,22.54 11.35,40.88 41.67,12.94 41.67,10.87 40.8,13.89 38.89,13.89 38.89,9.92 40.8,9.92 30.88,4.37 25,3.97 20.64,3.73 9.37,18.26 11.51,18.26 27.3,12.14 27.94,9.84 30.48,10 30.56,12.22 26.19,16.43 28.1,19.05 44.85,9.53 48.26,6.27 42.62,13.97 28.02,28.1 31.59,29.37 17.7,19.92 17.78,22.3 0.75,22.7 17.7,28.73 17.54,32.38 5,35.56 4.21,43.66 17.78,37.7 17.78,34.77 21.91,33.42 21.91,35.16 26.43,39.61 22.23,38.1 20.32,33.34 20.32,35.24 9.21,49.93 13.89,46.12 22.94,31.83 30.48,35.16 25.96,30.56 29.05,36.2 32.31,33.81 24.61,45.09 23.26,48.02 24.92,48.02 26.75,26.75 22.86,25.64 25.32,23.97 25.32,22.62 25.32,25.4 22.62,17.78 23.81,18.81 26.91,20.24 22.94,22.15 10.4,48.9 50.8,45.24 52.15,46.28 55.4,45.4 54.29,46.43 56.12,49.93 57.31,48.82 60.48,49.53 55.8,41.12 52.78,37.86 54.85,30.64 54.85,36.99 49.37,43.02 42.62,48.1 58.98,44.61 63.34,45.72 41.99,28.02 6.11,34.53 5,33.42 9.76,38.18 10.87,35.72 11.67,33.89 10.24,32.31 5.08,41.51 3.73,40.01 5.08,38.5 5.08,37.62 26.59,17.62 9.76,22.86 14.84,22.86 16.99,13.89 15.16,28.5 15.16,26.04 11.99,25.24 14.13,32.46 13.34,36.59 7.94,41.59 59.93,15.64 61.2,15.64 62.47,15.64 58.66,14.37 59.93,14.37 61.2,14.37 62.47,14.37 58.66,13.1 59.93,13.1 61.2,13.1 62.47,13.1 63.98,5.79 62.15,11.83 23.81,28.57 50.24,40.72 52.47,30.64 39.13,49.29 46.43,33.81 58.82,11.03 0.74,31.11 0.74,26.91 0.74,19.21 12.62,7.46 0.79,10.79 1.83,13.57 1.83,12.22 4.45,12.86 3.1,11.51 7.94,8.81 6.43,17.7 16.99,16.19 15.88,17.62 14.92,0.79 14.45,4.92 15.64,5.79 16.91,6.59 16.91,7.78 9.53,10.64 12.06,20.4 16.19,19.05 6.03,10.72 2.06,9.53 40.72,35.24 25,13.02 21.19,13.02 33.26,48.66 31.51,52.7 12.86,15.72
  pour Bottom (isolate 0.305): 31.75,20.95 45.72,20.95 45.72,10.79 58.42,10.79 58.42,15.88 64.77,15.88 64.77,0 52.07,0 52.07,3.17 49.37,3.17 49.37,1.91 38.1,1.91 38.1,0 0,0 0,53.34 31.75,53.34
  pour Bottom (isolate 0.305): 31.11,30.48 31.11,53.34 64.77,53.34 64.77,44.45 56.2,44.45 56.2,37.47 55.24,37.47 55.24,30.48
  pour Bottom (isolate 0.254): 45.72,15.24 45.72,31.11 39.37,31.11 39.37,15.24
  pour Top (isolate 0.254): 45.72,15.24 45.72,30.48 39.37,30.48 39.37,15.24
  pour Top (isolate 0.305): 31.11,30.48 31.11,53.34 64.77,53.34 64.77,44.45 56.2,44.45 56.2,37.47 55.24,37.47 55.24,30.48
  pour Top (isolate 0.305): 31.75,20.95 45.72,20.95 45.72,10.79 58.42,10.79 58.42,15.88 64.77,15.88 64.77,0 52.07,0 52.07,3.17 49.37,3.17 49.37,1.91 38.1,1.91 38.1,0 0,0 0,53.34 31.75,53.34
IGAIN  (1 unrouted)
  Top 0.254: R17.2 47.76,52.7 50.16,52.7 JP2.2 53.98,52.7 63.5,52.7 64.14,52.07 64.14,18.26 63.26,17.38 63.26,8.26 62.87,7.86 61.59,7.86 | 60.38,7.76 60.48,7.86 61.59,7.86 | IC5.5 61.41,7.12 61.59,7.3 61.59,7.86
ISENS+  (via drill 0.33)
  Top 0.254: IC5.1 57.49,9.07 v57.71,9.29 | 51.15,13.06 R1C.V2 51.18,12.86 51.67,12.86 52.07,12.46 52.07,11.27 v51.83,11.03
  Bottom 0.254: R1A.SENSE2 49.53,12.62 | v57.71,9.29 57.94,9.53 57.94,10.08 57.71,10.32 52.55,10.32 v51.83,11.03 52.07,11.27 52.07,12.46 51.83,12.7 49.91,12.7 R1B.V2 50.42,12.51 R1C.V2
  Bottom 0.406: R1B.V2 49.53,12.51 49.53,12.62
ISENS-  (via drill 0.33)
  Top 0.254: IC5.8 58.87,9.07 v58.66,9.29 | 53.54,13.06 R1C.V1 53.52,12.86 53.02,12.86 52.63,12.46 52.63,11.27 v52.86,11.03
  Bottom 0.254: 55.8,12.62 R1A.SENSE1 54.45,12.62 | 54.45,12.62 53.98,12.62 | v58.66,9.29 58.42,9.53 58.42,10.32 57.94,10.79 53.1,10.79 v52.86,11.03 52.63,11.27 52.63,12.46 52.86,12.7 54.37,12.7 54.45,12.62
  Bottom 0.406: R1B.V1 53.98,12.51 53.98,12.62
LED
  Top 0.254: T3.1 57.33,51.67 R28.1 55.46,51.65 JP2.3
N$1
  Top 0.254: IC2.4 4.19,14.86 5.71,13.34 5.71,12.14 9.53,8.33 10.08,8.33 11.68,6.73 IC1.3
N$2
  Top 0.254: R6.2 9.15,19.23 8.57,18.65 8.57,18.49 8.1,18.02 7.7,18.02 5.83,16.15 IC2.2
N$3  (via drill 0.33, 0.38)
  Top 0.254: 5.32,21.11 5.1,21.33 C27.1 | 5.32,21.11 5.1,20.9 C23.2 5.1,18.89 R25.2 | v27.86,23.34 v22.78,23.34 | TH1.1 30.57,23.32 v30.56,23.34 | 5.32,21.11 v8.81,21.11 15.48,21.11 v17.7,23.34
  Top 0.406: IC7.6 5.62,22.59 C27.1
  Bottom 0.254: v30.56,23.34 v27.86,23.34 | v22.78,23.34 v17.7,23.34
N$4
  Top 0.406: LED1.C 62.23,49.84 T3.3
N$5
  Top 0.406: IC9.6 20.15,4.43 20.48,4.76 20.48,7.01 C29.1
N$6
  Top 0.406: IC9.3 21.86,7.76 C29.2
N$9
  Top 0.254: C1.2 12.12,9.32 13.57,7.86 R3.2
N$10  (via drill 0.33)
  Top 0.254: IC2.14 7.39,15.49 | 7.39,15.49 6.91,15 6.91,11.91 v9.76,9.05 | v9.76,7.62 9.76,6.11 11.67,4.21 11.67,3.64 IC1.4 | IC2.15 7.66,16.15 7.39,15.89 7.39,15.49
  Bottom 0.254: v9.76,9.05 v9.76,7.62
N$11  (1 unrouted)
  Top 0.406: 50.16,14.92 50.48,14.92 50.68,15.12
  Top 0.813: R1C.I2 50.97,14.83 50.68,15.12 50.56,15.24
  Top 1.27: D8.A 47.98,28.45 47.7,28.18 47.7,24.46 T1.S
  Top 1.778: 50.16,14.92 48.34,14.92 47.39,15.88 47.39,18.02 T1.S
  Bottom 0.406: R1B.I2 48.9,15.01 48.9,15.88 48.61,15.88 R1A.POWER2
N$12  (via drill 0.33)
  Top 0.406: R2.2 33.28,32.33 29.61,28.65 v29.61,21.67 | v28.18,20.24 v25.32,17.38 | v24.13,16.19 18.1,16.19 16.11,14.21 16.11,13.1 15.53,12.52 R4.1 C4.2 15.53,9.53 C2.2 R3.1 15.53,7.2 14.55,6.22 IC1.1
  Bottom 0.406: v29.61,21.67 v28.18,20.24 | v25.32,17.38 v24.13,16.19
N$13  (via drill 0.33)
  Top 0.254: D7.C 47.9,40.52 | D7.C 48.06,40.52 46.75,39.21 43.02,39.21 41.51,40.72 34.58,40.72 R12.2 | D7.C 48.78,40.52 50.09,41.83 v58.42,41.83
  Bottom 0.254: v58.42,41.83 60.13,43.54 REL1.P$6
N$14  (via drill 0.33, 0.38)
  Top 0.254: v27.86,24.61 v22.78,24.61 | TH1.2 30.57,24.62 v30.56,24.61 | C27.2 7.62,22.07 | 7.62,22.07 v8.81,22.07 15.16,22.07 v17.7,24.61 | R19.2 12.62,38.52 12.62,35 13.34,34.29 v13.34,29.13 | v13.34,26.04 11.59,26.04 7.62,22.07
  Top 0.406: IC7.7 6.28,22.59 C27.2
  Bottom 0.254: v30.56,24.61 v27.86,24.61 | v22.78,24.61 v17.7,24.61 | v13.34,29.13 v13.34,26.04
N$15
  Top 0.254: R5.2 3.25,16.93 IC2.1
N$16
  Top 0.406: R29.2 61.77,46.75 LED1.A
N$17
  Top 0.254: REL1.P$3 60.13,41.15 58.74,42.55 58.1,42.55 57.86,42.31 49.93,42.31 49.45,41.83 46.12,41.83 45.56,41.27 45.2,41.27 D6.C 42.35,40.52 41.67,41.2 35.8,41.2 34.53,42.47 R13.1
N$18
  Top 0.254: R4.2 13.83,14.02 C3.2
N$20
  Top 0.254: IC7.3 5.62,29.33 C25.2 6.27,30 5.71,30.56 3.49,30.56 | R23.1 3.49,30.56 | 3.49,30.56 R24.2
N$22
  Top 0.254: R13.2 32.33,42.07 30.88,42.07 30.7,42.24 IC3.4 29.38,44.29 C8.2 28.18,45.11 R11.2
N$24
  Top 0.813: REL1.P$8 51.97,43.67 D2.A 51.67,44.13 53.18,45.64 53.18,47.23 53.1,47.31 T2.3
N$26
  Top 1.016: X2.1 61.2,4.68 60.64,4.13 57.7,4.13 D3.A 56.44,4.45 55.17,3.17 T4.3
N$30
  Top 0.254: IC4.1 37.94,45.91 37.94,46.67 37.78,46.83 29.45,46.83 28.6,47.68 R11.1 R10.2
N$34  (via drill 0.33)
  Top 0.254: IC3.3 30.7,41.1 30.88,41.27 31.43,41.27 | 31.43,41.27 32.33,41.27 R12.1 | R9.2 30.24,45.16 31.59,43.81 v31.59,42.78 | v31.59,40.56 31.59,41.12 31.43,41.27
  Bottom 0.254: v31.59,42.78 v31.59,40.56
N$36
  Top 0.254: IC4.2 37.31,45.09 37.07,44.85 35.34,44.85 R14.2
N$37
  Top 0.254: R9.1 R8.2 R14.1
PWR+  (via drill 0.33)  (1 unrouted)
  Top 0.254: X1.2 60.25,24.09 60.25,22.46 60.8,21.91 61.99,21.91 63.18,23.1 63.18,25.4 61.67,26.91 58.34,26.91 56.99,28.26 56.99,39.77 56.75,40.01 v56.75,41.04
  Top 3.81: X1.2 51.92,24.17 D1.C
  Bottom 0.254: REL1.P$7 57.4,43.67 56.75,43.02 v56.75,41.04
  Bottom 1.27: X1.2 60.33,24.69
  Bottom 3.556: 48.9,26.67 55.24,26.67 55.24,26.59 57.15,24.69 60.33,24.69 60.72,24.69
REMOTE
  Top 0.254: R16.2 55.3,48.26 T2.1 48.82,48.26 46.91,50.16 41.02,50.16 JP3.10
SCL
  Top 0.254: JP3.1 15.16,50.8 | R26.1 15.24,50.88 15.16,50.8 | IC6.10 14.88,46.23 12.18,48.94 | 12.18,48.94 11.67,49.45 11.67,50.4 12.06,50.8 15.16,50.8 | IC8.7 1.24,37.66 1.03,37.86 1.03,38.73 3.41,41.12 3.41,43.81 2.46,44.77 2.46,47.86 4.05,49.45 8.18,49.45 9.53,48.1 11.35,48.1 12.18,48.94
SDA  (via drill 0.33)
  Top 0.254: JP3.2 20.07,52.01 19.37,52.7 14.29,52.7 13.65,52.07 R27.1 12.6,51.65 v12.46,51.51 11.91,51.51 11.19,50.8 3.1,50.8 1.59,49.29 1.59,44.45 1.98,44.05 1.98,40.56 0.56,39.13 0.56,37.7 1.11,37.15 IC8.8 | IC6.9 15.37,46.62 12.46,49.53 v12.46,50.09
  Bottom 0.254: v12.46,50.09 v12.46,51.51
SENS+
  Top 0.254: REL1.P$5 62.33,42.01 61.28,40.96 61.28,39.85 61.83,39.29 61.83,38.18 63.1,36.91 63.1,33.73 61.28,31.91 60.64,31.91 60.33,32.23 X1.4
SENS-
  Top 0.254: REL1.P$4 62.39,40.41 62.39,38.34 63.58,37.15 63.58,33.5 61.52,31.43 60.64,31.43 60.33,31.11 X1.3
VCCIO  (via drill 0.33)
  Top 0.254: IC6.8 15.88,45.74 C22.1 | R27.2 R26.2 15.53,49.95 16.59,48.9 17.46,48.9 18.93,47.43 | R30.1 50.09,5.56 43.81,11.83 43.81,13.97 42.62,15.16 32.31,15.16 29.37,12.22 | R18.2 19.53,48.02 18.93,47.43 | 18.93,47.43 18.49,46.99 18.49,44.61 v18.57,44.53 | v19.21,40.48 19.21,38.26 19.05,38.1 | 19.05,30.72 18.97,30.72 | IC8.1 6.94,36.16 7.38,35.72 C15.2 | IC8.2 7.35,36.64 7.58,36.87 | C13.2 7.86,37.15 7.58,36.87 | 29.53,12.22 29.37,12.22 | 29.37,12.22 29.21,12.06 | IC8.3 7.3,37.15 7.58,36.87
  Top 0.406: v32.38,16.35 32.54,16.19 43.74,16.19 45.64,14.29 45.64,11.91 48.18,9.37 53.18,9.37 54.11,8.44 C12.1 54.44,7.77 IC5.3 | IC4.5 38.16,44 C9.2 39.45,43.42 v38.1,42.07 | v38.1,39.93 36.27,38.1 35.56,38.1 27.15,29.69 v22.78,29.69 | IC3.5 27.55,42.97 C7.1 27.36,41.7 v27.38,41.67 | C22.1 17.2,46.14 17.62,45.72 v17.62,44.37 | v18.49,41.27 18.49,38.66 19.05,38.1 | IC7.8 6.92,24.22 7.88,25.18 C26.1 9.47,25.18 11.19,26.91 17.22,26.91 19.05,25.08 | v30.96,14.92 29.53,13.49 29.53,12.22 | v27.38,39.13 27.38,38.81 v22.86,34.29 | 18.89,25.56 19.05,25.4 | C13.2 8.04,39.87 C14.1 9.29,40.01 v10.87,38.42 | v13.49,37.62 18.81,32.31 19.05,32.31 | C15.2 7.49,35.17 C16.1 7.49,33.71 9.68,31.51 v11.75,31.51 | v13.97,31.51 18.65,31.51 19.05,31.11 | IC2.16 10.2,16.81 C6.1 15.9,16.53 16.35,16.99 v19.05,16.99
  Top 1.27: JP1.5 29.21,4.52 28.81,4.92 28.81,5.84 C31.1 28.89,5.92 28.89,6.27 29.21,6.59 29.21,12.06 26.99,14.29 v19.76,14.29 v19.05,15 | 19.05,38.1 v19.05,34.29 19.05,32.31 19.05,31.11 19.05,30.72 v19.05,29.69 19.05,25.4 19.05,25.08 v19.05,20.32
  Bottom 0.254: v18.57,44.53 18.57,44.45 19.21,43.81 v19.21,40.48
  Bottom 0.406: v38.1,42.07 v38.1,39.93 | v27.38,41.67 v27.38,39.13 | v17.62,44.37 18.49,43.5 v18.49,41.27 | v32.38,16.35 v30.96,14.92 | v22.86,34.29 v19.05,34.29 | v22.78,29.69 v19.05,29.69 | v10.87,38.42 12.7,38.42 v13.49,37.62 | v11.75,31.51 v13.97,31.51
  Bottom 1.27: v19.05,21.43 v19.05,20.32 v19.05,16.99 v19.05,15 v19.76,14.29
VDOUBLE  (via drill 0.38)
  Top 0.406: IC9.5 17.81,5.4 C30.1 17.46,4.76 19.53,2.69 D4.C v19.53,0.8 v19.53,0.79 | 17.46,5.4 17.46,5.58
  Top 0.813: IC9.5 17.46,5.4 | 17.46,4.76 15.98,4.76 C5.2 13.64,3.71 IC1.5
VGAIN
  Top 0.254: IC4.4 36.74,43.8 37.7,44.77 38.18,44.77 38.58,45.16 38.58,47.07 37.73,47.92 R15.1 37.85,48.22 JP3.9
VOLTAGE  (via drill 0.33, 0.38)
  Top 0.254: R10.1 26.11,44.74 C8.1 25,44.29 23.73,43.02 23.73,42.55 25.4,40.88 28.32,40.88 IC3.1 | IC3.1 25.11,40.38 23.18,42.31 23.18,43.18 23.89,43.89 23.89,45.16 23.3,45.76 | R21.2 23.1,45.96 23.3,45.76 | v21.83,18.65 20.88,17.7 16.99,17.7 16.35,18.34 12.94,18.34 11.99,17.38 7.94,17.38 6.04,15.49 IC2.3 | v22.86,19.68 22.86,20.4 22.07,21.19 22.07,32.15 28.83,38.91 IC3.1 | v24.13,46.83 24.13,46.59 23.3,45.76
  Bottom 0.254: v21.83,18.65 v22.86,19.68

### Text on the board
tPlace: GND | GND | SCL | SDA | 12 | 11 | 9 | 8 | 5 | 4 | 3 | VOLTAGE | GATE | SENS+ | DAC-OUT | VREF | SENS- | GND | PWR+ | BIAS | TEMP | T2 | PWR- | MightyWatt | CURRENT | GND | revision 3.1 | VDOUBLE | GND | IOREF | 5V | GND | GND
bPlace: GND | SCL | SDA | 12 | 11 | 9 | 8 | 5 | 4 | 3 | GND | VOLTAGE | GATE | VREF | DAC-OUT | kaktus circuits / Czech Republic / 2020 / CC-BY-SA / jpolonsky@gmail.com | Electronic Load | MightyWatt | GND | TEMP | BIAS | T2 | CURRENT | GND | GND | IOREF | 5V | GND | GND | VDOUBLE